# Altium project Optisk_probe.PrjPcb
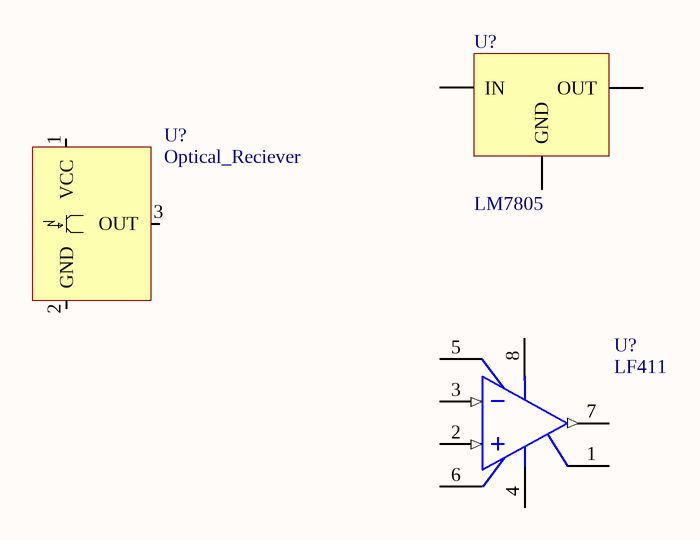
[diagram p0: Optisk_probe.SchDoc]
1 sheet, 3 parts. Net scope: global (net labels, ports and power ports of the same name join across sheets).
Board file: Optisk_probe.PcbDoc

## Sheet Optisk_probe.SchDoc
size A4

### Parts
(Parts that share a designator on the sheet are numbered #1, #2 ... from top to bottom, then left to right.)
U?#1  LM7805  [TO-220-3P]
U?#2  Optical_Reciever  [TOSLINK_TH]
U?#3  LF411  [DIP8]

### Nets
2: U?#1.4

Not connected (* = marked no-connect by the designer): U?#1 1(IN) 2(GND) 3(OUT); U?#2 1(VCC) 2(GND) 3(OUT); U?#3 1(GND) 2(IN+) 3(IN-) 4(V-) 5(BAL) 6(BAL/STB) 7(OUT) 8(V+)

### Notes on the sheet
- Size:
- Date:
- Title:
- A3
- Revision:
- Sheet
- of
- Author:
- File:

### Library data of the parts
U?#1 = 1433: Voltage Regulator; id: 1433; rad: 0; rom: OV; lager_type: Fremlager; hylle: 9; antall: 40; pakke_opprettet_av: 815; pakke_opprettet: 09.06.2015 21.08.41; symbol_opprettet: 20.06.2015 13.45.33; leverandor_varenr: 152-3798; pris: 8; produsent: Fairchild; leverandor: Farnell; pakketype: TH; dybde: 0; kolonne: 0; symbol_opprettet_av: 815; navn: LM7805
U?#2 = 2380: TOSLINK Reciever; id: 2380; pakke_opprettet_av: 815; pakke_opprettet: 28.06.2014 18.02.12; symbol_opprettet: 28.06.2014 15.42.01; leverandor_varenr: 1243863; navn: GP1FAV50RK; pris: 12; nokkelord: Optic, fibre, optisk, fiber; produsent: Sharp; leverandor: Farnell; pakketype: TH; symbol_opprettet_av: 815
U?#3 = 1462: Operational Amplifier, Single, 4 MHz, 1 Amplifier, 15 V/µs, 10V to 36V, DIP, 8 Pins; id: 1462; rad: 4; rom: OV; lager_type: Fremlager; dybde: 0; hylle: 9; antall: 40; kolonne: 1; pakke_opprettet_av: 815; pakke_opprettet: 15.06.2014 14.59.01; symbol_opprettet: 28.06.2014 15.35.20; nokkelord: opamp; pakketype: TH; symbol_opprettet_av: 815; navn: LF411; pris: 9